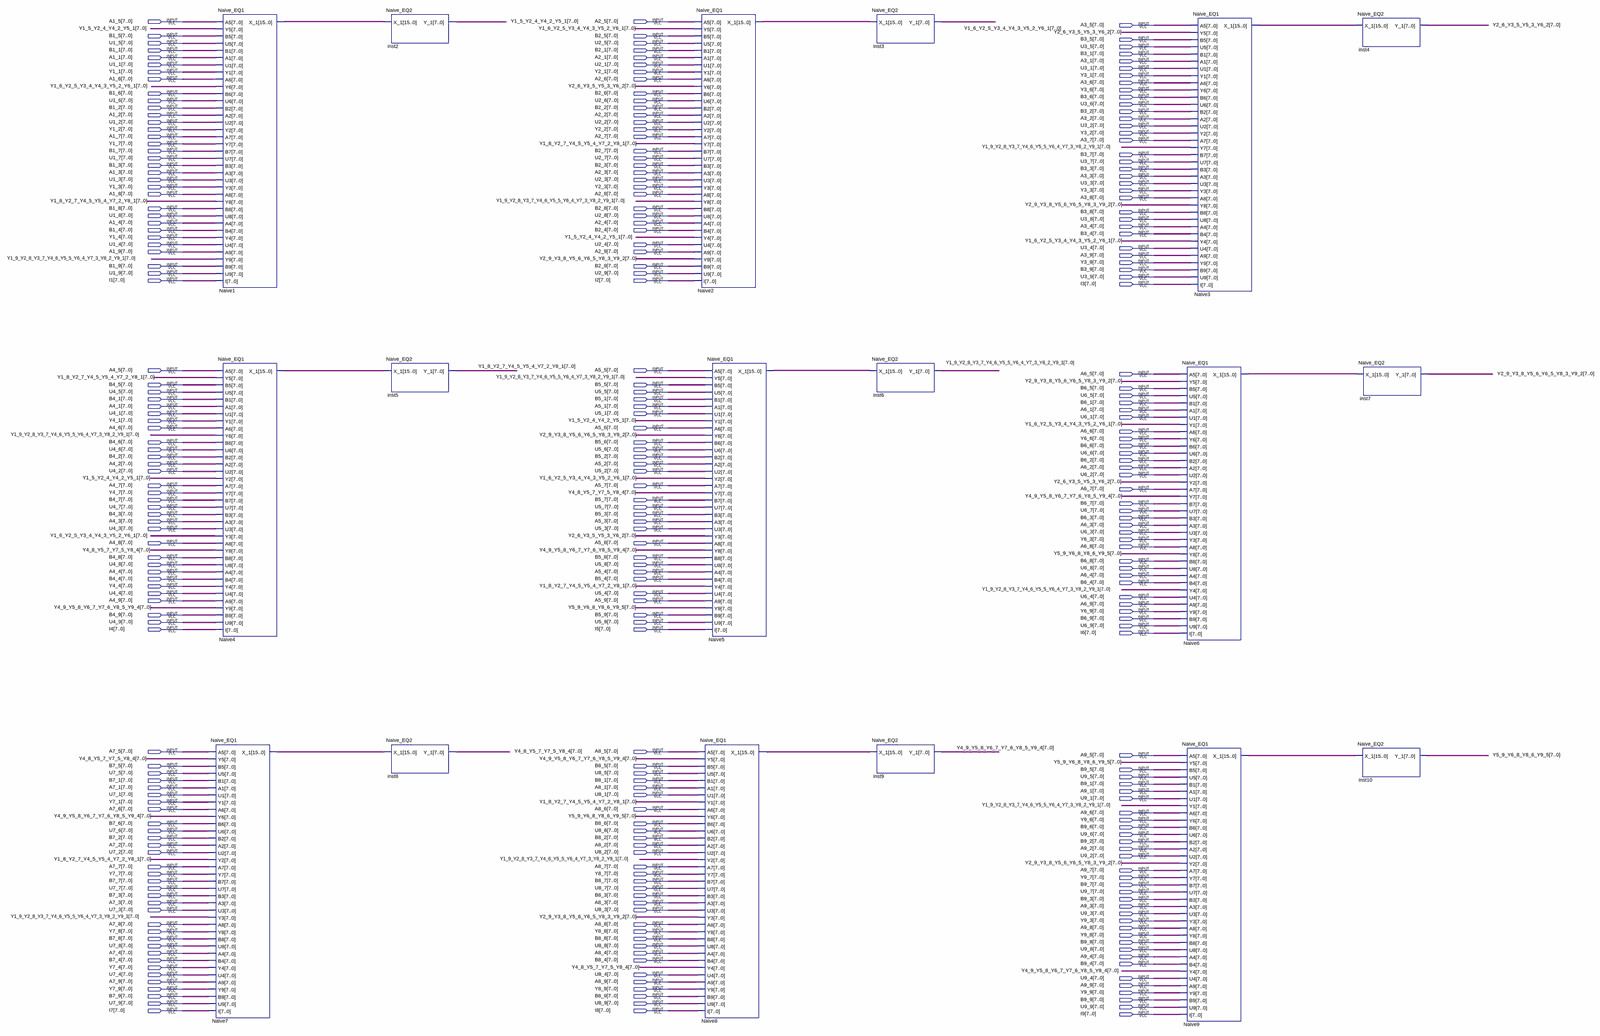
[diagram p0: schematic sheet, whole]
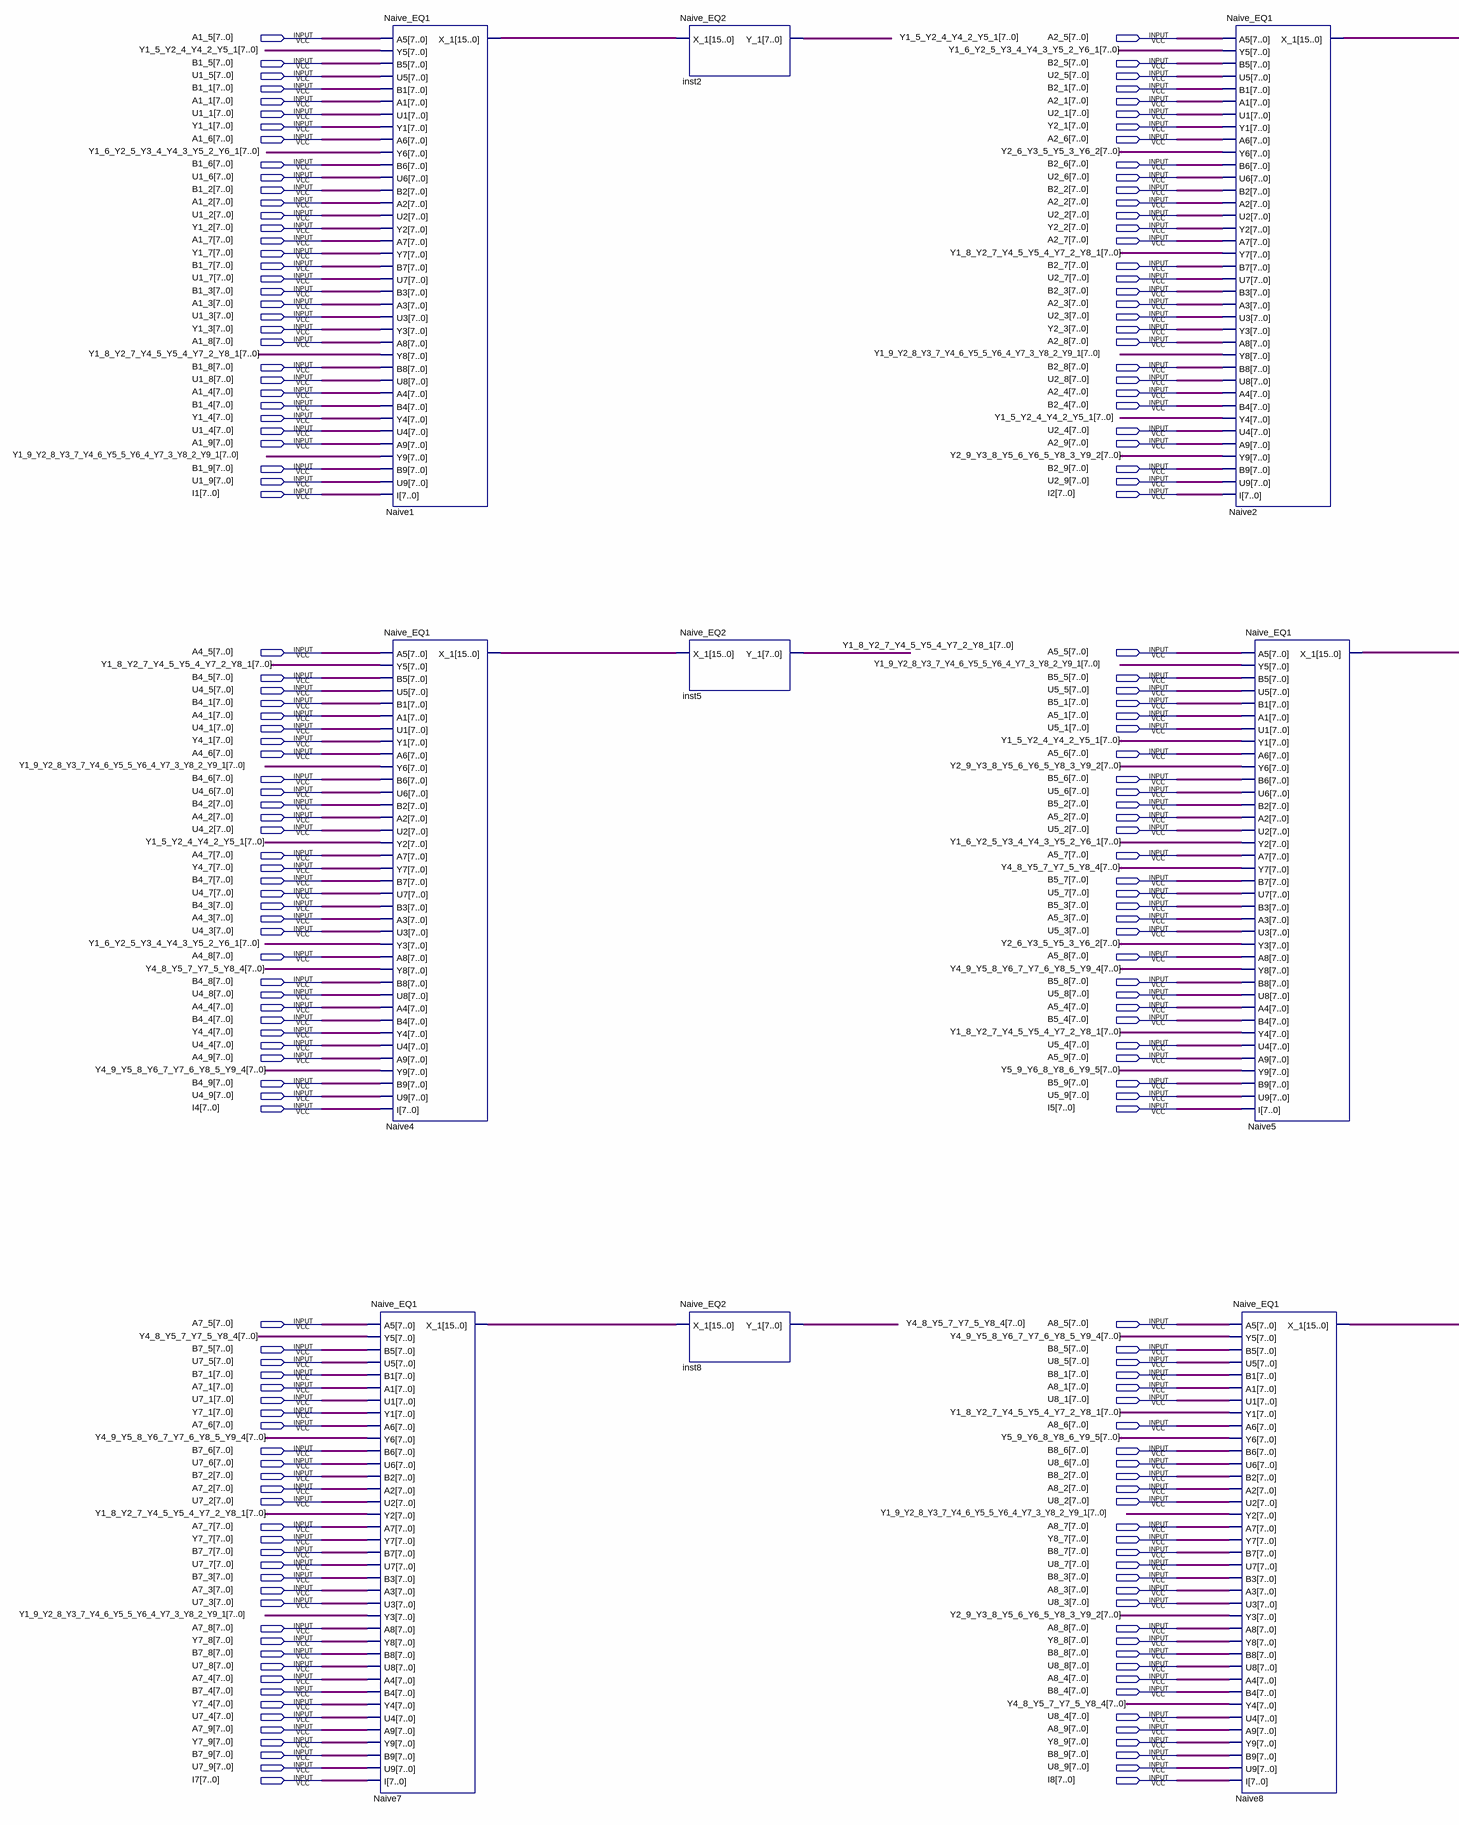
[diagram p1: schematic sheet, left part]
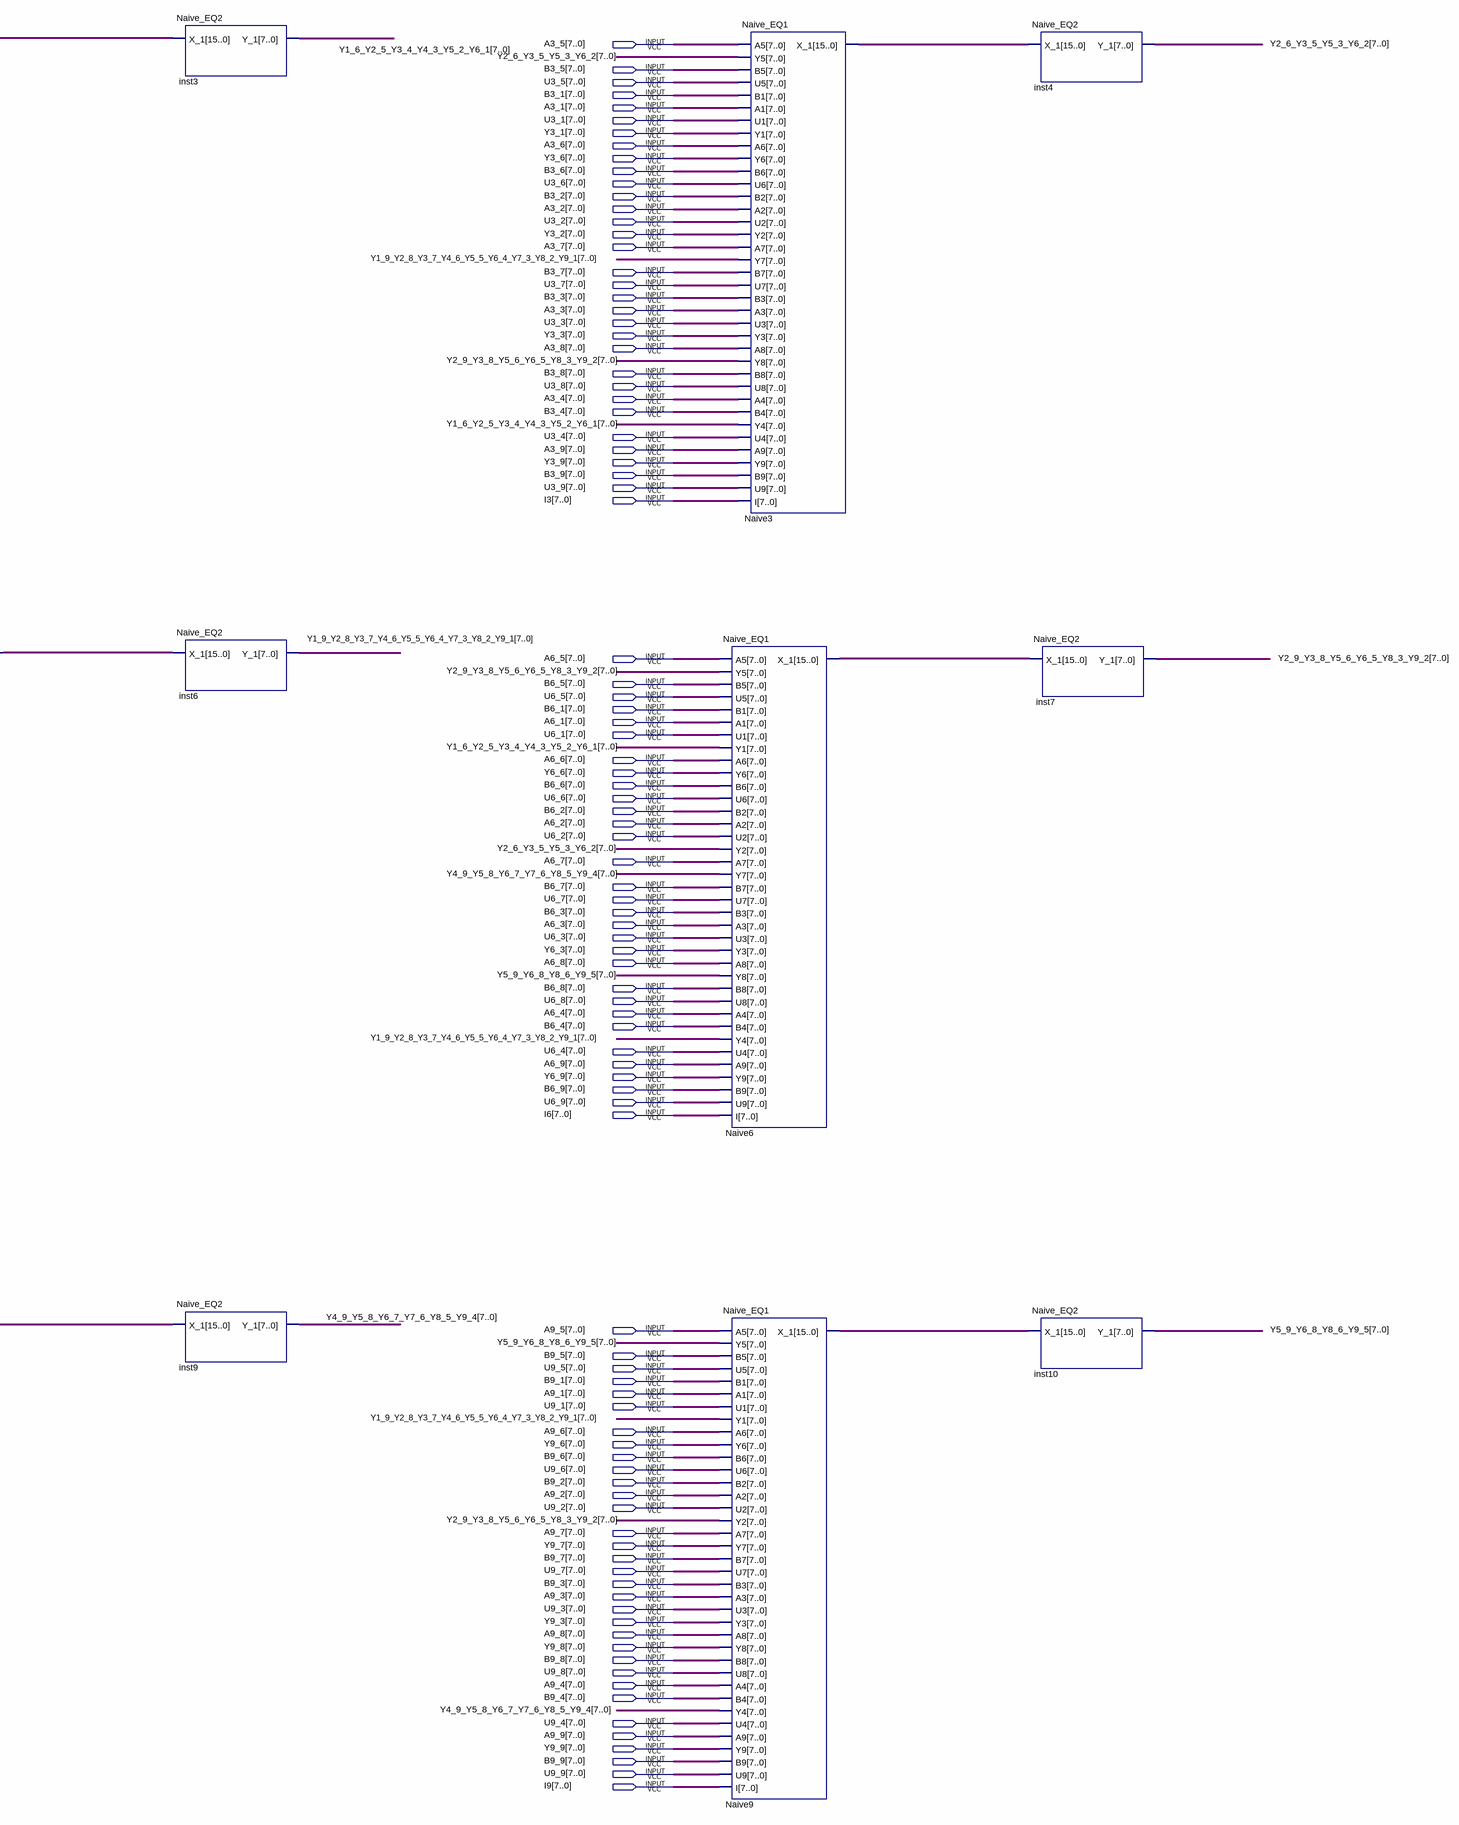
[diagram p2: schematic sheet, right part]
// Quartus schematic 3by3.bdf as structural Verilog: 18 symbols, 284 pins
module \3by3  (
  input  [7:0] A1_5,
  input  [7:0] A2_5,
  input  [7:0] A3_5,
  input  [7:0] B1_5,
  input  [7:0] B2_5,
  input  [7:0] B3_5,
  input  [7:0] U1_5,
  input  [7:0] U2_5,
  input  [7:0] U3_5,
  input  [7:0] B1_1,
  input  [7:0] B2_1,
  input  [7:0] B3_1,
  input  [7:0] A1_1,
  input  [7:0] A2_1,
  input  [7:0] A3_1,
  input  [7:0] U1_1,
  input  [7:0] U2_1,
  input  [7:0] U3_1,
  input  [7:0] Y1_1,
  input  [7:0] Y2_1,
  input  [7:0] Y3_1,
  input  [7:0] A1_6,
  input  [7:0] A2_6,
  input  [7:0] A3_6,
  input  [7:0] Y3_6,
  input  [7:0] B1_6,
  input  [7:0] B2_6,
  input  [7:0] B3_6,
  input  [7:0] U1_6,
  input  [7:0] U2_6,
  input  [7:0] U3_6,
  input  [7:0] B1_2,
  input  [7:0] B2_2,
  input  [7:0] B3_2,
  input  [7:0] A1_2,
  input  [7:0] A2_2,
  input  [7:0] A3_2,
  input  [7:0] U1_2,
  input  [7:0] U2_2,
  input  [7:0] U3_2,
  input  [7:0] Y1_2,
  input  [7:0] Y2_2,
  input  [7:0] Y3_2,
  input  [7:0] A1_7,
  input  [7:0] A2_7,
  input  [7:0] A3_7,
  input  [7:0] Y1_7,
  input  [7:0] B1_7,
  input  [7:0] B2_7,
  input  [7:0] B3_7,
  input  [7:0] U1_7,
  input  [7:0] U2_7,
  input  [7:0] U3_7,
  input  [7:0] B1_3,
  input  [7:0] B2_3,
  input  [7:0] B3_3,
  input  [7:0] A1_3,
  input  [7:0] A2_3,
  input  [7:0] A3_3,
  input  [7:0] U1_3,
  input  [7:0] U2_3,
  input  [7:0] U3_3,
  input  [7:0] Y1_3,
  input  [7:0] Y2_3,
  input  [7:0] Y3_3,
  input  [7:0] A1_8,
  input  [7:0] A2_8,
  input  [7:0] A3_8,
  input  [7:0] B1_8,
  input  [7:0] B2_8,
  input  [7:0] B3_8,
  input  [7:0] U1_8,
  input  [7:0] U2_8,
  input  [7:0] U3_8,
  input  [7:0] A1_4,
  input  [7:0] A2_4,
  input  [7:0] A3_4,
  input  [7:0] B1_4,
  input  [7:0] B2_4,
  input  [7:0] B3_4,
  input  [7:0] Y1_4,
  input  [7:0] U1_4,
  input  [7:0] U2_4,
  input  [7:0] U3_4,
  input  [7:0] A1_9,
  input  [7:0] A2_9,
  input  [7:0] A3_9,
  input  [7:0] Y3_9,
  input  [7:0] B1_9,
  input  [7:0] B2_9,
  input  [7:0] B3_9,
  input  [7:0] U1_9,
  input  [7:0] U2_9,
  input  [7:0] U3_9,
  input  [7:0] I1,
  input  [7:0] I2,
  input  [7:0] I3,
  input  [7:0] A4_5,
  input  [7:0] A5_5,
  input  [7:0] A6_5,
  input  [7:0] B4_5,
  input  [7:0] B5_5,
  input  [7:0] B6_5,
  input  [7:0] U4_5,
  input  [7:0] U5_5,
  input  [7:0] U6_5,
  input  [7:0] B4_1,
  input  [7:0] B5_1,
  input  [7:0] B6_1,
  input  [7:0] A4_1,
  input  [7:0] A5_1,
  input  [7:0] A6_1,
  input  [7:0] U4_1,
  input  [7:0] U5_1,
  input  [7:0] U6_1,
  input  [7:0] Y4_1,
  input  [7:0] A4_6,
  input  [7:0] A5_6,
  input  [7:0] A6_6,
  input  [7:0] Y6_6,
  input  [7:0] B4_6,
  input  [7:0] B5_6,
  input  [7:0] B6_6,
  input  [7:0] U4_6,
  input  [7:0] U5_6,
  input  [7:0] U6_6,
  input  [7:0] B4_2,
  input  [7:0] B5_2,
  input  [7:0] B6_2,
  input  [7:0] A4_2,
  input  [7:0] A5_2,
  input  [7:0] A6_2,
  input  [7:0] U4_2,
  input  [7:0] U5_2,
  input  [7:0] U6_2,
  input  [7:0] A4_7,
  input  [7:0] A5_7,
  input  [7:0] A6_7,
  input  [7:0] Y4_7,
  input  [7:0] B4_7,
  input  [7:0] B5_7,
  input  [7:0] B6_7,
  input  [7:0] U4_7,
  input  [7:0] U5_7,
  input  [7:0] U6_7,
  input  [7:0] B4_3,
  input  [7:0] B5_3,
  input  [7:0] B6_3,
  input  [7:0] A4_3,
  input  [7:0] A5_3,
  input  [7:0] A6_3,
  input  [7:0] U4_3,
  input  [7:0] U5_3,
  input  [7:0] U6_3,
  input  [7:0] Y6_3,
  input  [7:0] A4_8,
  input  [7:0] A5_8,
  input  [7:0] A6_8,
  input  [7:0] B4_8,
  input  [7:0] B5_8,
  input  [7:0] B6_8,
  input  [7:0] U4_8,
  input  [7:0] U5_8,
  input  [7:0] U6_8,
  input  [7:0] A4_4,
  input  [7:0] A5_4,
  input  [7:0] A6_4,
  input  [7:0] B4_4,
  input  [7:0] B5_4,
  input  [7:0] B6_4,
  input  [7:0] Y4_4,
  input  [7:0] U4_4,
  input  [7:0] U5_4,
  input  [7:0] U6_4,
  input  [7:0] A4_9,
  input  [7:0] A5_9,
  input  [7:0] A6_9,
  input  [7:0] Y6_9,
  input  [7:0] B4_9,
  input  [7:0] B5_9,
  input  [7:0] B6_9,
  input  [7:0] U4_9,
  input  [7:0] U5_9,
  input  [7:0] U6_9,
  input  [7:0] I4,
  input  [7:0] I5,
  input  [7:0] I6,
  input  [7:0] A7_5,
  input  [7:0] A8_5,
  input  [7:0] A9_5,
  input  [7:0] B7_5,
  input  [7:0] B8_5,
  input  [7:0] B9_5,
  input  [7:0] U7_5,
  input  [7:0] U8_5,
  input  [7:0] U9_5,
  input  [7:0] B7_1,
  input  [7:0] B8_1,
  input  [7:0] B9_1,
  input  [7:0] A7_1,
  input  [7:0] A8_1,
  input  [7:0] A9_1,
  input  [7:0] U7_1,
  input  [7:0] U8_1,
  input  [7:0] U9_1,
  input  [7:0] Y7_1,
  input  [7:0] A7_6,
  input  [7:0] A8_6,
  input  [7:0] A9_6,
  input  [7:0] Y9_6,
  input  [7:0] B7_6,
  input  [7:0] B8_6,
  input  [7:0] B9_6,
  input  [7:0] U7_6,
  input  [7:0] U8_6,
  input  [7:0] U9_6,
  input  [7:0] B7_2,
  input  [7:0] B8_2,
  input  [7:0] B9_2,
  input  [7:0] A7_2,
  input  [7:0] A8_2,
  input  [7:0] A9_2,
  input  [7:0] U7_2,
  input  [7:0] U8_2,
  input  [7:0] U9_2,
  input  [7:0] A7_7,
  input  [7:0] A8_7,
  input  [7:0] A9_7,
  input  [7:0] Y7_7,
  input  [7:0] Y8_7,
  input  [7:0] Y9_7,
  input  [7:0] B7_7,
  input  [7:0] B8_7,
  input  [7:0] B9_7,
  input  [7:0] U7_7,
  input  [7:0] U8_7,
  input  [7:0] U9_7,
  input  [7:0] B7_3,
  input  [7:0] B8_3,
  input  [7:0] B9_3,
  input  [7:0] A7_3,
  input  [7:0] A8_3,
  input  [7:0] A9_3,
  input  [7:0] U7_3,
  input  [7:0] U8_3,
  input  [7:0] U9_3,
  input  [7:0] Y9_3,
  input  [7:0] A7_8,
  input  [7:0] A8_8,
  input  [7:0] A9_8,
  input  [7:0] Y7_8,
  input  [7:0] Y8_8,
  input  [7:0] Y9_8,
  input  [7:0] B7_8,
  input  [7:0] B8_8,
  input  [7:0] B9_8,
  input  [7:0] U7_8,
  input  [7:0] U8_8,
  input  [7:0] U9_8,
  input  [7:0] A7_4,
  input  [7:0] A8_4,
  input  [7:0] A9_4,
  input  [7:0] B7_4,
  input  [7:0] B8_4,
  input  [7:0] B9_4,
  input  [7:0] Y7_4,
  input  [7:0] U7_4,
  input  [7:0] U8_4,
  input  [7:0] U9_4,
  input  [7:0] A7_9,
  input  [7:0] A8_9,
  input  [7:0] A9_9,
  input  [7:0] Y7_9,
  input  [7:0] Y8_9,
  input  [7:0] Y9_9,
  input  [7:0] B7_9,
  input  [7:0] B8_9,
  input  [7:0] B9_9,
  input  [7:0] U7_9,
  input  [7:0] U8_9,
  input  [7:0] U9_9,
  input  [7:0] I7,
  input  [7:0] I8,
  input  [7:0] I9
);

  wire [7:0] Y1_5_Y2_4_Y4_2_Y5_1, Y1_6_Y2_5_Y3_4_Y4_3_Y5_2_Y6_1, Y1_8_Y2_7_Y4_5_Y5_4_Y7_2_Y8_1,
       Y1_9_Y2_8_Y3_7_Y4_6_Y5_5_Y6_4_Y7_3_Y8_2_Y9_1, Y2_6_Y3_5_Y5_3_Y6_2, Y2_9_Y3_8_Y5_6_Y6_5_Y8_3_Y9_2,
       Y4_8_Y5_7_Y7_5_Y8_4, Y4_9_Y5_8_Y6_7_Y7_6_Y8_5_Y9_4, Y5_9_Y6_8_Y8_6_Y9_5;
  wire [15:0] Naive1_x_1, Naive2_x_1, Naive3_x_1, Naive4_x_1, Naive5_x_1, Naive6_x_1, Naive7_x_1, Naive8_x_1,
       Naive9_x_1;

  Naive_EQ1 Naive1 (
    .A5(A1_5), .Y5(Y1_5_Y2_4_Y4_2_Y5_1), .B5(B1_5), .U5(U1_5), .B1(B1_1), .A1(A1_1), .U1(U1_1), .Y1(Y1_1),
    .A6(A1_6), .Y6(Y1_6_Y2_5_Y3_4_Y4_3_Y5_2_Y6_1), .B6(B1_6), .U6(U1_6), .B2(B1_2), .A2(A1_2), .U2(U1_2),
    .Y2(Y1_2), .A7(A1_7), .Y7(Y1_7), .B7(B1_7), .U7(U1_7), .B3(B1_3), .A3(A1_3), .U3(U1_3), .Y3(Y1_3),
    .A8(A1_8), .Y8(Y1_8_Y2_7_Y4_5_Y5_4_Y7_2_Y8_1), .B8(B1_8), .U8(U1_8), .A4(A1_4), .B4(B1_4), .Y4(Y1_4),
    .U4(U1_4), .A9(A1_9), .Y9(Y1_9_Y2_8_Y3_7_Y4_6_Y5_5_Y6_4_Y7_3_Y8_2_Y9_1), .B9(B1_9), .U9(U1_9), .I(I1),
    .X_1(Naive1_x_1));
  Naive_EQ1 Naive4 (
    .A5(A4_5), .Y5(Y1_8_Y2_7_Y4_5_Y5_4_Y7_2_Y8_1), .B5(B4_5), .U5(U4_5), .B1(B4_1), .A1(A4_1), .U1(U4_1),
    .Y1(Y4_1), .A6(A4_6), .Y6(Y1_9_Y2_8_Y3_7_Y4_6_Y5_5_Y6_4_Y7_3_Y8_2_Y9_1), .B6(B4_6), .U6(U4_6), .B2(B4_2),
    .A2(A4_2), .U2(U4_2), .Y2(Y1_5_Y2_4_Y4_2_Y5_1), .A7(A4_7), .Y7(Y4_7), .B7(B4_7), .U7(U4_7), .B3(B4_3),
    .A3(A4_3), .U3(U4_3), .Y3(Y1_6_Y2_5_Y3_4_Y4_3_Y5_2_Y6_1), .A8(A4_8), .Y8(Y4_8_Y5_7_Y7_5_Y8_4), .B8(B4_8),
    .U8(U4_8), .A4(A4_4), .B4(B4_4), .Y4(Y4_4), .U4(U4_4), .A9(A4_9), .Y9(Y4_9_Y5_8_Y6_7_Y7_6_Y8_5_Y9_4),
    .B9(B4_9), .U9(U4_9), .I(I4), .X_1(Naive4_x_1));
  Naive_EQ1 Naive7 (
    .A5(A7_5), .Y5(Y4_8_Y5_7_Y7_5_Y8_4), .B5(B7_5), .U5(U7_5), .B1(B7_1), .A1(A7_1), .U1(U7_1), .Y1(Y7_1),
    .A6(A7_6), .Y6(Y4_9_Y5_8_Y6_7_Y7_6_Y8_5_Y9_4), .B6(B7_6), .U6(U7_6), .B2(B7_2), .A2(A7_2), .U2(U7_2),
    .Y2(Y1_8_Y2_7_Y4_5_Y5_4_Y7_2_Y8_1), .A7(A7_7), .Y7(Y7_7), .B7(B7_7), .U7(U7_7), .B3(B7_3), .A3(A7_3),
    .U3(U7_3), .Y3(Y1_9_Y2_8_Y3_7_Y4_6_Y5_5_Y6_4_Y7_3_Y8_2_Y9_1), .A8(A7_8), .Y8(Y7_8), .B8(B7_8), .U8(U7_8),
    .A4(A7_4), .B4(B7_4), .Y4(Y7_4), .U4(U7_4), .A9(A7_9), .Y9(Y7_9), .B9(B7_9), .U9(U7_9), .I(I7),
    .X_1(Naive7_x_1));
  Naive_EQ2 inst2 (.X_1(Naive1_x_1), .Y_1(Y1_5_Y2_4_Y4_2_Y5_1));
  Naive_EQ2 inst5 (.X_1(Naive4_x_1), .Y_1(Y1_8_Y2_7_Y4_5_Y5_4_Y7_2_Y8_1));
  Naive_EQ2 inst8 (.X_1(Naive7_x_1), .Y_1(Y4_8_Y5_7_Y7_5_Y8_4));
  Naive_EQ1 Naive2 (
    .A5(A2_5), .Y5(Y1_6_Y2_5_Y3_4_Y4_3_Y5_2_Y6_1), .B5(B2_5), .U5(U2_5), .B1(B2_1), .A1(A2_1), .U1(U2_1),
    .Y1(Y2_1), .A6(A2_6), .Y6(Y2_6_Y3_5_Y5_3_Y6_2), .B6(B2_6), .U6(U2_6), .B2(B2_2), .A2(A2_2), .U2(U2_2),
    .Y2(Y2_2), .A7(A2_7), .Y7(Y1_8_Y2_7_Y4_5_Y5_4_Y7_2_Y8_1), .B7(B2_7), .U7(U2_7), .B3(B2_3), .A3(A2_3),
    .U3(U2_3), .Y3(Y2_3), .A8(A2_8), .Y8(Y1_9_Y2_8_Y3_7_Y4_6_Y5_5_Y6_4_Y7_3_Y8_2_Y9_1), .B8(B2_8), .U8(U2_8),
    .A4(A2_4), .B4(B2_4), .Y4(Y1_5_Y2_4_Y4_2_Y5_1), .U4(U2_4), .A9(A2_9), .Y9(Y2_9_Y3_8_Y5_6_Y6_5_Y8_3_Y9_2),
    .B9(B2_9), .U9(U2_9), .I(I2), .X_1(Naive2_x_1));
  Naive_EQ1 Naive5 (
    .A5(A5_5), .Y5(Y1_9_Y2_8_Y3_7_Y4_6_Y5_5_Y6_4_Y7_3_Y8_2_Y9_1), .B5(B5_5), .U5(U5_5), .B1(B5_1), .A1(A5_1),
    .U1(U5_1), .Y1(Y1_5_Y2_4_Y4_2_Y5_1), .A6(A5_6), .Y6(Y2_9_Y3_8_Y5_6_Y6_5_Y8_3_Y9_2), .B6(B5_6), .U6(U5_6),
    .B2(B5_2), .A2(A5_2), .U2(U5_2), .Y2(Y1_6_Y2_5_Y3_4_Y4_3_Y5_2_Y6_1), .A7(A5_7), .Y7(Y4_8_Y5_7_Y7_5_Y8_4),
    .B7(B5_7), .U7(U5_7), .B3(B5_3), .A3(A5_3), .U3(U5_3), .Y3(Y2_6_Y3_5_Y5_3_Y6_2), .A8(A5_8),
    .Y8(Y4_9_Y5_8_Y6_7_Y7_6_Y8_5_Y9_4), .B8(B5_8), .U8(U5_8), .A4(A5_4), .B4(B5_4),
    .Y4(Y1_8_Y2_7_Y4_5_Y5_4_Y7_2_Y8_1), .U4(U5_4), .A9(A5_9), .Y9(Y5_9_Y6_8_Y8_6_Y9_5), .B9(B5_9), .U9(U5_9),
    .I(I5), .X_1(Naive5_x_1));
  Naive_EQ1 Naive8 (
    .A5(A8_5), .Y5(Y4_9_Y5_8_Y6_7_Y7_6_Y8_5_Y9_4), .B5(B8_5), .U5(U8_5), .B1(B8_1), .A1(A8_1), .U1(U8_1),
    .Y1(Y1_8_Y2_7_Y4_5_Y5_4_Y7_2_Y8_1), .A6(A8_6), .Y6(Y5_9_Y6_8_Y8_6_Y9_5), .B6(B8_6), .U6(U8_6), .B2(B8_2),
    .A2(A8_2), .U2(U8_2), .Y2(Y1_9_Y2_8_Y3_7_Y4_6_Y5_5_Y6_4_Y7_3_Y8_2_Y9_1), .A7(A8_7), .Y7(Y8_7), .B7(B8_7),
    .U7(U8_7), .B3(B8_3), .A3(A8_3), .U3(U8_3), .Y3(Y2_9_Y3_8_Y5_6_Y6_5_Y8_3_Y9_2), .A8(A8_8), .Y8(Y8_8),
    .B8(B8_8), .U8(U8_8), .A4(A8_4), .B4(B8_4), .Y4(Y4_8_Y5_7_Y7_5_Y8_4), .U4(U8_4), .A9(A8_9), .Y9(Y8_9),
    .B9(B8_9), .U9(U8_9), .I(I8), .X_1(Naive8_x_1));
  Naive_EQ2 inst3 (.X_1(Naive2_x_1), .Y_1(Y1_6_Y2_5_Y3_4_Y4_3_Y5_2_Y6_1));
  Naive_EQ2 inst6 (.X_1(Naive5_x_1), .Y_1(Y1_9_Y2_8_Y3_7_Y4_6_Y5_5_Y6_4_Y7_3_Y8_2_Y9_1));
  Naive_EQ2 inst9 (.X_1(Naive8_x_1), .Y_1(Y4_9_Y5_8_Y6_7_Y7_6_Y8_5_Y9_4));
  Naive_EQ1 Naive6 (
    .A5(A6_5), .Y5(Y2_9_Y3_8_Y5_6_Y6_5_Y8_3_Y9_2), .B5(B6_5), .U5(U6_5), .B1(B6_1), .A1(A6_1), .U1(U6_1),
    .Y1(Y1_6_Y2_5_Y3_4_Y4_3_Y5_2_Y6_1), .A6(A6_6), .Y6(Y6_6), .B6(B6_6), .U6(U6_6), .B2(B6_2), .A2(A6_2),
    .U2(U6_2), .Y2(Y2_6_Y3_5_Y5_3_Y6_2), .A7(A6_7), .Y7(Y4_9_Y5_8_Y6_7_Y7_6_Y8_5_Y9_4), .B7(B6_7), .U7(U6_7),
    .B3(B6_3), .A3(A6_3), .U3(U6_3), .Y3(Y6_3), .A8(A6_8), .Y8(Y5_9_Y6_8_Y8_6_Y9_5), .B8(B6_8), .U8(U6_8),
    .A4(A6_4), .B4(B6_4), .Y4(Y1_9_Y2_8_Y3_7_Y4_6_Y5_5_Y6_4_Y7_3_Y8_2_Y9_1), .U4(U6_4), .A9(A6_9), .Y9(Y6_9),
    .B9(B6_9), .U9(U6_9), .I(I6), .X_1(Naive6_x_1));
  Naive_EQ1 Naive9 (
    .A5(A9_5), .Y5(Y5_9_Y6_8_Y8_6_Y9_5), .B5(B9_5), .U5(U9_5), .B1(B9_1), .A1(A9_1), .U1(U9_1),
    .Y1(Y1_9_Y2_8_Y3_7_Y4_6_Y5_5_Y6_4_Y7_3_Y8_2_Y9_1), .A6(A9_6), .Y6(Y9_6), .B6(B9_6), .U6(U9_6), .B2(B9_2),
    .A2(A9_2), .U2(U9_2), .Y2(Y2_9_Y3_8_Y5_6_Y6_5_Y8_3_Y9_2), .A7(A9_7), .Y7(Y9_7), .B7(B9_7), .U7(U9_7),
    .B3(B9_3), .A3(A9_3), .U3(U9_3), .Y3(Y9_3), .A8(A9_8), .Y8(Y9_8), .B8(B9_8), .U8(U9_8), .A4(A9_4),
    .B4(B9_4), .Y4(Y4_9_Y5_8_Y6_7_Y7_6_Y8_5_Y9_4), .U4(U9_4), .A9(A9_9), .Y9(Y9_9), .B9(B9_9), .U9(U9_9),
    .I(I9), .X_1(Naive9_x_1));
  Naive_EQ1 Naive3 (
    .A5(A3_5), .Y5(Y2_6_Y3_5_Y5_3_Y6_2), .B5(B3_5), .U5(U3_5), .B1(B3_1), .A1(A3_1), .U1(U3_1), .Y1(Y3_1),
    .A6(A3_6), .Y6(Y3_6), .B6(B3_6), .U6(U3_6), .B2(B3_2), .A2(A3_2), .U2(U3_2), .Y2(Y3_2), .A7(A3_7),
    .Y7(Y1_9_Y2_8_Y3_7_Y4_6_Y5_5_Y6_4_Y7_3_Y8_2_Y9_1), .B7(B3_7), .U7(U3_7), .B3(B3_3), .A3(A3_3), .U3(U3_3),
    .Y3(Y3_3), .A8(A3_8), .Y8(Y2_9_Y3_8_Y5_6_Y6_5_Y8_3_Y9_2), .B8(B3_8), .U8(U3_8), .A4(A3_4), .B4(B3_4),
    .Y4(Y1_6_Y2_5_Y3_4_Y4_3_Y5_2_Y6_1), .U4(U3_4), .A9(A3_9), .Y9(Y3_9), .B9(B3_9), .U9(U3_9), .I(I3),
    .X_1(Naive3_x_1));
  Naive_EQ2 inst4 (.X_1(Naive3_x_1), .Y_1(Y2_6_Y3_5_Y5_3_Y6_2));
  Naive_EQ2 inst10 (.X_1(Naive9_x_1), .Y_1(Y5_9_Y6_8_Y8_6_Y9_5));
  Naive_EQ2 inst7 (.X_1(Naive6_x_1), .Y_1(Y2_9_Y3_8_Y5_6_Y6_5_Y8_3_Y9_2));
endmodule
